# EAGLE design USB_stick (EAGLE 7.2.0)
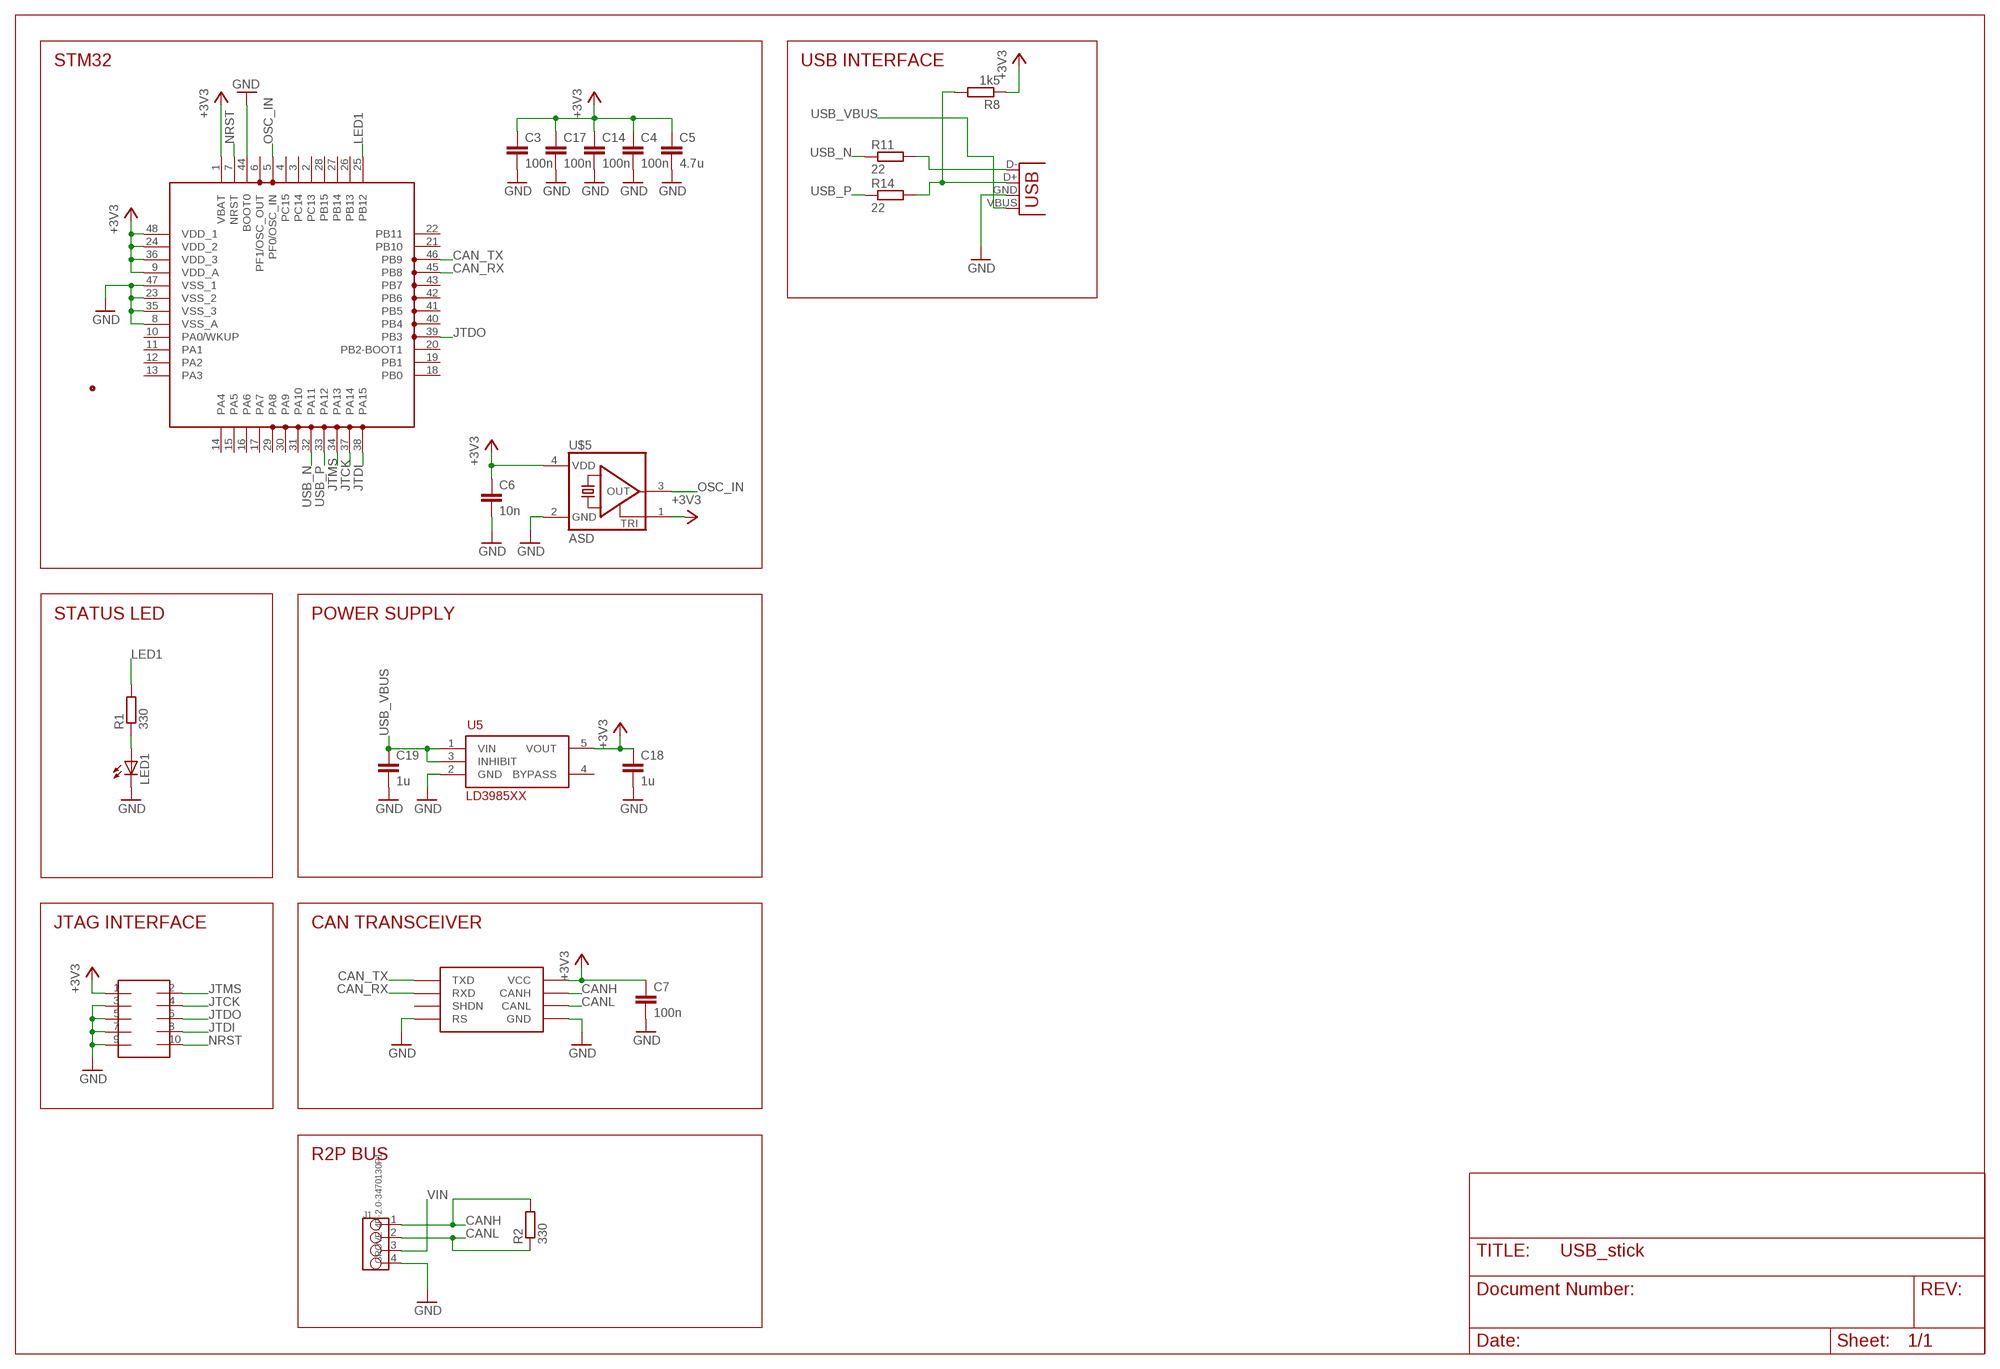
[diagram p0: schematic, sheet 1]

## Parts
C3  100n  C-EUC0603  [C0603]
C4  100n  C-EUC0603  [C0603]
C5  4.7u  C-EUC0805  [C0805]
C6  10n  C-EUC0603  [C0603]
C7  100n  C-EUC0603  [C0603]
C14  100n  C-EUC0603  [C0603]
C17  100n  C-EUC0603  [C0603]
C18  1u  C-EUC0603  [C0603]
C19  1u  C-EUC0603  [C0603]
J1  GROVE-4P-2.0-3470130P1  [4P-2.0]
JP1  USB-A-H  [USB-A-H]
LED1  LEDCHIPLED_0805  [CHIPLED_0805]
R1  330  R0603  [R0603]
R2  330  R0603  [R0603]
R8  1k5  R0603  [R0603]
R11  22  R0603  [R0603]
R14  22  R0603  [R0603]
SOT1  MAX3051EKA  [SOT23-8L]
U5  LD3985XX  [SOT23-5L]
U$4  FTSH-105TH  [FTSH-105-TH]
U$5  ASD  [2.5X2]
U$6  STM32F303C  [LQFP48]

## Nets
+3V3: C3.1 C4.1 C5.1 C6.1 C7.1 C14.1 C17.1 C18.1 R8.1 SOT1.3(VCC) U5.5(VOUT) U$4.1 U$5.1(TRI) U$5.4(VDD) U$6.1(VBAT) U$6.9(VDD_A) U$6.24(VDD_2) U$6.36(VDD_3) U$6.48(VDD_1)
CAN_RX: SOT1.4(RXD) U$6.45(PB8)
CAN_TX: SOT1.1(TXD) U$6.46(PB9)
CANH: J1.1 R2.2 SOT1.7(CANH)
CANL: J1.2 R2.1 SOT1.6(CANL)
GND: C3.2 C4.2 C5.2 C6.2 C7.2 C14.2 C17.2 C18.2 C19.2 J1.4 JP1.GND(VBUS) LED1.C SOT1.2(GND) SOT1.8(RS) U5.2(GND) U$4.3 U$4.5 U$4.7 U$4.9 U$5.2(GND) U$6.8(VSS_A) U$6.23(VSS_2) U$6.35(VSS_3) U$6.44(BOOT0) U$6.47(VSS_1)
JTCK: U$4.4 U$6.37(PA14)
JTDI: U$4.8 U$6.38(PA15)
JTDO: U$4.6 U$6.39(PB3)
JTMS: U$4.2 U$6.34(PA13)
LED1: R1.2 U$6.25(PB12)
N$3: JP1.D-(D+) R11.2
N$4: LED1.A R1.1
N$32: JP1.D+(D-) R8.2 R14.2
NRST: U$4.10 U$6.7(NRST)
OSC_IN: U$5.3(OUT) U$6.5(PF0/OSC_IN)
USB_N: R11.1 U$6.32(PA11)
USB_P: R14.1 U$6.33(PA12)
USB_VBUS: C19.1 JP1.VBUS(GND) U5.1(VIN) U5.3(INHIBIT)
VIN: J1.3
Unconnected: SOT1.5(SHDN) U5.4(BYPASS) U$6.2(PC13) U$6.3(PC14) U$6.4(PC15) U$6.6(PF1/OSC_OUT) U$6.10(PA0/WKUP) U$6.11(PA1) U$6.12(PA2) U$6.13(PA3) U$6.14(PA4) U$6.15(PA5) U$6.16(PA6) U$6.17(PA7) U$6.18(PB0) U$6.19(PB1) U$6.20(PB2-BOOT1) U$6.21(PB10) U$6.22(PB11) U$6.26(PB13) U$6.27(PB14) U$6.28(PB15) U$6.29(PA8) U$6.30(PA9) U$6.31(PA10) U$6.40(PB4) U$6.41(PB5) U$6.42(PB6) U$6.43(PB7)

## Notes on the sheet
- STM32 | USB INTERFACE
- STATUS LED | POWER SUPPLY
- JTAG INTERFACE | CAN TRANSCEIVER
- R2P BUS

## Library data of the parts
C3-C7 C14 C17-C19 = rcl:C-EU: CAPACITOR, European symbol
J1 = OPL Eagle Library:GROVE-4P-2.0
JP1 = SparkFun-Connectors:USB: USB Connectors USB-B-PTH is fully proven SKU : PRT-00139/CONN-08278 USB-miniB is fully proven SKU : PRT-00587 USB-A-PCB is untested. USB-A-H is throughly reviewed, but untested. Spark Fun Electronics SKU : PRT-00437 USB-B-SMT is throughly reviewed, but untested. Needs silkscreen touching up. USB-A-S has not been used/tested USB-MB-H has not been used/tested USB-MICROB has been used. CONN-09505
LED1 = led:LED: LED OSRAM: - CHIPLED LG R971, LG N971, LY N971, LG Q971, LY Q971, LO R971, LY R971 LH N974, LH R974 LS Q976, LO Q976, LY Q976 LO Q996 - Hyper CHIPLED LW Q18S LB Q993, LB Q99A, LB R99A - SideLED LS A670, LO A670, LY A670, LG A670, LP A670 LB A673, LV A673, LT A673, LW A673 LH A674 LY A675 LS A676, LA A676, LO A676, LY A676, LW A676 LS A679, LY A679, LG A679 - Hyper Micro SIDELED® LS Y876, LA Y876, LO Y876, LY Y876 LT Y87S - SmartLED LW L88C, LW L88S LB L89C, LB L89S, LG L890 LS L89K, LO L89K, LY L89K LS L896, LA L896, LO L896, LY L896 - TOPLED LS T670, LO T670, LY T670, LG T670, LP T670 LSG T670, LSP T670, LSY T670, LOP T670, LYG T670 LG T671, LOG T671, LSG T671 LB T673, LV T673, LT T673, LW T673 LH T674 LS T676, LA T676, LO T676, LY T676, LB T676, LH T676, LSB T676, LW T676 LB T67C, LV T67C, LT T67C, LS T67K, LO T67K, LY T67K, LW E67C LS E67B, LA E67B, LO E67B, LY E67B, LB E67C, LV E67C, LT E67C LW T67C LS T679, LY T679, LG T679 LS T770, LO T770, LY T770, LG T770, LP T770 LB T773, LV T773, LT T773, LW T773 LH T774 LS E675, LA E675, LY E675, LS T675 LS T776, LA T776, LO T776, LY T776, LB T776 LHGB T686 LT T68C, LB T68C - Hyper Mini TOPLED® LB M676 - Mini TOPLED Santana® LG M470 LS M47K, LO M47K, LY M47K Source: http://www.osram.convergy.de LUXEON: - LUMILED® LXK2-PW12-R00, LXK2-PW12-S00, LXK2-PW14-U00, LXK2-PW14-V00 LXK2-PM12-R00, LXK2-PM12-S00, LXK2-PM14-U00 LXK2-PE12-Q00, LXK2-PE12-R00, LXK2-PE12-S00, LXK2-PE14-T00, LXK2-PE14-U00 LXK2-PB12-K00, LXK2-PB12-L00, LXK2-PB12-M00, LXK2-PB14-N00, LXK2-PB14-P00, LXK2-PB14-Q00 LXK2-PR12-L00, LXK2-PR12-M00, LXK2-PR14-Q00, LXK2-PR14-R00 LXK2-PD12-Q00, LXK2-PD12-R00, LXK2-PD12-S00 LXK2-PH12-R00, LXK2-PH12-S00 LXK2-PL12-P00, LXK2-PL12-Q00, LXK2-PL12-R00 Source: www.luxeon.com KINGBRIGHT: KA-3528ASYC Source: www.kingbright.com
R1 R2 R8 R11 R14 = r2p_rcl:R
SOT1 = maxim:MAX3051
U5 = st:LD3985XX
U$4 = samtec:FTSH-105
U$5 = abracon:ASD
U$6 = st:STM32F303C

## Board
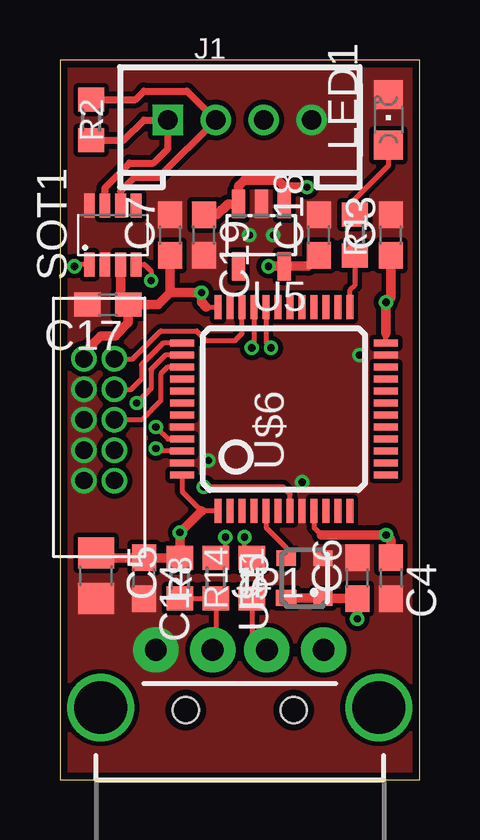
[diagram p1: board, top side]
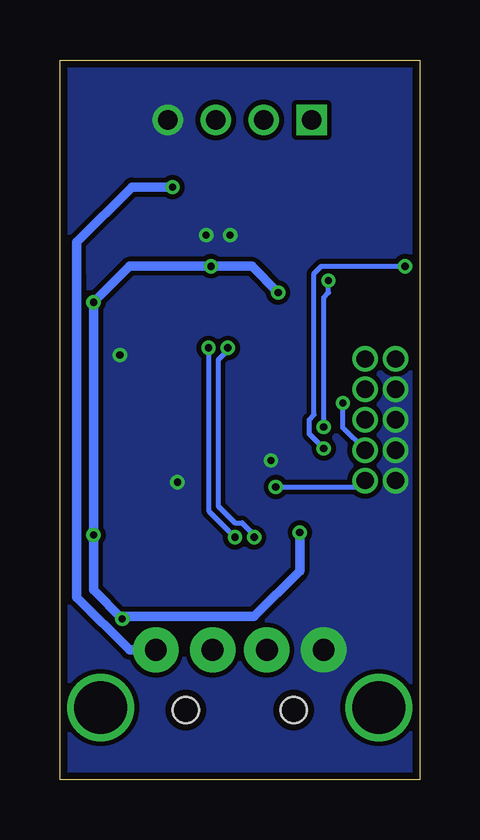
[diagram p2: board, bottom side, seen from below]

Size 15 x 30 mm. Coordinates in mm from the lower left corner, seen from the top.
Outline: 0,0 15,0 15,30 0,30 0,0
Copper layers (1*16): Top 0.035mm / dielectric 1.5mm / Bottom 0.035mm
Design rules "2layer_0.2mm": minimum track width 0.2mm, minimum drill 0.3mm, track to track 0.2mm, track to pad 0.2mm, pad to pad 0.2mm, via to via 0.2mm, smd to smd 0mil, copper to edge 0.3mm, drill to drill 0.3mm, minimum pad ring 0.15mm, minimum via ring 0.15mm, stop-mask expansion 0.05mm, vias tented up to drill 2.5mm, thermal gap 0.25mm

### Footprints (pad centres in the part's own frame; a part is rotated, then mirrored left to right if it is on the bottom)
C0603 = smd 1.1 x 1: 1 -0.85,0; 2 0.85,0
C0805 = smd 1.3 x 1.5: 1 -0.95,0; 2 0.95,0
4P-2.0 = drill 0.8 pad 1.27 square: 1 -3,0 | drill 0.8 pad 1.27: 2 -1,0; 3 1,0; 4 3,0
USB-A-H = drill 0.914 pad 1.88: D+ 2.4,1.127; D- 2.4,-1.127; GND 2.4,3.5; VBUS 2.4,-3.5 | drill 2.2: GND2 0,-5.8; GND3 0,5.8 | hole 1.1: -0.1,2.25; -0.1,-2.25
CHIPLED_0805 = smd 1.2 x 1.2: A 0,-1.05; C 0,1.05
R0603 = smd 1 x 1.1: 1 -0.85,0; 2 0.85,0
SOT23-8L = smd 0.45 x 1: 1 -0.975,-1.225; 2 -0.325,-1.225; 3 0.325,-1.225; 4 0.975,-1.225; 5 0.975,1.225; 6 0.325,1.225; 7 -0.325,1.225; 8 -0.975,1.225
SOT23-5L = smd 0.55 x 1.2: 1 -0.95,-1.3; 2 0,-1.3; 3 0.95,-1.3; 4 0.95,1.3; 5 -0.95,1.3
FTSH-105-TH = drill 0.711 pad 1.016: 1 -2.54,0; 2 -2.54,1.27; 3 -1.27,0; 4 -1.27,1.27; 5 0,0; 6 0,1.27; 7 1.27,0; 8 1.27,1.27; 9 2.54,0; 10 2.54,1.27
2.5X2 = smd 0.65 x 0.8: 1 -0.825,-0.762; 2 0.825,-0.762; 3 0.825,0.762 | smd 0.65 x 0.85: 4 -0.825,0.762
LQFP48 = smd 1 x 0.3: 1 -4.25,2.75; 2 -4.25,2.25; 3 -4.25,1.75; 4 -4.25,1.25; 5 -4.25,0.75; 6 -4.25,0.25; 7 -4.25,-0.25; 8 -4.25,-0.75; 9 -4.25,-1.25; 10 -4.25,-1.75; 11 -4.25,-2.25; 12 -4.25,-2.75; 25 4.25,-2.75; 26 4.25,-2.25; 27 4.25,-1.75; 28 4.25,-1.25; 29 4.25,-0.75; 30 4.25,-0.25; 31 4.25,0.25; 32 4.25,0.75; 33 4.25,1.25; 34 4.25,1.75; 35 4.25,2.25; 36 4.25,2.75 | smd 0.3 x 1: 13 -2.75,-4.25; 14 -2.25,-4.25; 15 -1.75,-4.25; 16 -1.25,-4.25; 17 -0.75,-4.25; 18 -0.25,-4.25; 19 0.25,-4.25; 20 0.75,-4.25; 21 1.25,-4.25; 22 1.75,-4.25; 23 2.25,-4.25; 24 2.75,-4.25; 37 2.75,4.25; 38 2.25,4.25; 39 1.75,4.25; 40 1.25,4.25; 41 0.75,4.25; 42 0.25,4.25; 43 -0.25,4.25; 44 -0.75,4.25; 45 -1.25,4.25; 46 -1.75,4.25; 47 -2.25,4.25; 48 -2.75,4.25

### Placement (x,y rotation side)
C3  13.8,22.7 90 top
C4  13.8,8.4 270 top
C5  1.5,8.5 270 top
C6  12.4,8.4 90 top
C7  4.6,22.7 90 top
C14  3.5,8.4 270 top
C17  2,19.8 180 top
C18  10.8,22.7 90 top
C19  6,22.7 270 top
J1  7.5,27.5 0 top
JP1  7.5,3 90 top
LED1  13.7,27.5 0 top
R1  12.3,22.7 270 top
R2  1.3,27.5 270 top
R8  5,8.4 270 top
R11  8,8.4 270 top
R14  6.5,8.4 270 top
SOT1  2.2,22.7 0 top
U5  8.4,22.7 180 top
U$4  1,15 270 top
U$5  10.2,8.4 90 top
U$6  9.35,15.45 90 top

### Tracks (layer width: path | path; a pad name or v marks a point on that pad's centre or on a via)
+3V3  (via drill 0.3)
  Top 0.2: U$6.9 10.6,10.5 10.9,10.2 | U$6.48 5.1,12 5.9,11.2 U$6.1 | 6.1,19.7 U$6.36 | U$6.24 13.6,18.6
  Top 0.4: v8.7,21.4 U5.5 10.35,21.4 C18.1 | C4.1 13.8,10 v13.6,10.2 10.9,10.2 | U$5.4 U$5.1 10.99,7.55 C6.1 v12.4,6.7 | 5.9,11.2 v5,10.3 R8.1 C14.1 1.7,9.25 C5.1 | SOT1.3 2.52,20.12 C17.1 | C17.1 2.85,19.05 2.3,18.5 1.7,18.5 1,17.8 U$4.1 | 6.1,19.7 5.9,19.9 v5.9,20.3 4.6,20.3 | 4.6,20.3 4.1,19.8 C17.1 | C7.1 4.6,20.3 | 13.6,18.6 v13.6,19.9 13.8,20.1 C3.1
  Bottom 0.4: v5,10.3 5,8.7 6.9,6.8 12.3,6.8 v12.4,6.7 13.6,7.9 v13.6,10.2 v13.6,19.9 12.1,21.4 v8.7,21.4 7,21.4 v5.9,20.3
CAN_RX  (via drill 0.3)
  Top 0.2: SOT1.4 3.52,21.48 3.8,21.2 v3.8,20.8 | U$6.45 4.5,14.2 4.1,14.6 v4,14.7
  Bottom 0.2: v4,14.7 4,20.1 3.8,20.3 v3.8,20.8
CAN_TX  (via drill 0.3)
  Top 0.2: SOT1.1 0.68,21.48 v0.6,21.4 | U$6.46 4.1,13.7 v4,13.8
  Bottom 0.2: v4,13.8 4.1,13.9 4.6,14.4 4.6,15 4.4,15.2 4.4,21.1 4.1,21.4 v0.6,21.4
CANH
  Top 0.3: R2.2 2.65,26.65 3.5,27.5 J1.1 4.5,26.3 3.9,25.7 2.9,25.7 1.88,24.68 SOT1.7
CANL
  Top 0.3: R2.1 3.15,28.35 3.5,28.7 5.3,28.7 J1.2 4.1,25.1 3.1,25.1 2.52,24.52 SOT1.6
GND  (via drill 0.3)
  other vias: 7.9,22.7 8.9,22.7 10.1,12.4 6.2,13.3 12.5,17.7
  pour Top (no thermals): 15,30 0,30 0,0 15,0
  pour Bottom (no thermals): 0,0 15,0 15,30 0,30
JTCK
  Top 0.2: U$6.37 4.3,18.2 3.4,17.3 3.4,16.7 2.97,16.27 U$4.4
JTDI  (via drill 0.3)
  Top 0.2: U$6.38 4.4,17.7 3.8,17.1 3.8,16.3 v3.2,15.7
  Bottom 0.2: U$4.8 3.2,14.66 v3.2,15.7
JTDO
  Top 0.2: U$6.39 4.5,17.2 4.2,16.9 4.2,15.8 3.4,15 U$4.6
JTMS
  Top 0.2: U$4.2 3.04,17.54 4.2,18.7 5.7,18.7 6.1,18.3 7.3,18.3 7.6,18.6 U$6.34
LED1
  Top 0.2: R1.2 12.3,20.6 12.1,20.4 U$6.25
N$3
  Top 0.2: R11.2 8,6.03 JP1.D-
N$4
  Top 0.2: LED1.A 13.7,25.6 12.3,24.2 R1.1
N$32
  Top 0.2: JP1.D+ 6.5,5.53 R14.2 R8.2
NRST  (via drill 0.3)
  Top 0.2: U$6.7 9.6,11.9 9.3,12.2 v6,12.2
  Bottom 0.2: v6,12.2 2.53,12.2 U$4.10
OSC_IN
  Top 0.2: U$6.5 8.6,10.5 9.4,9.7 9.44,9.66 U$5.3
USB_N  (via drill 0.3)
  Top 0.2: U$6.32 8.6,18.2 v8.8,18 | R11.1 7.7,9.55 v7.7,10.1
  Bottom 0.2: v8.8,18 8.8,11.2 v7.7,10.1
USB_P  (via drill 0.3)
  Top 0.2: U$6.33 8.1,18.1 v8,18 | R14.1 6.9,9.65 v6.9,10.1
  Bottom 0.2: v8,18 8,17.9 8.4,17.5 8.4,11.4 7.7,10.7 7.4,10.7 6.9,10.2 v6.9,10.1
USB_VBUS  (via drill 0.3)
  Top 0.4: U5.1 9.35,24.7 | 9.35,24.7 9.35,24.75 9.1,25 7.7,25 7.5,24.8 7.45,24.75 U5.3 7,24 6.55,23.55 C19.1 | v10.3,24.7 9.35,24.7
  Bottom 0.4: v10.3,24.7 12,24.7 14.3,22.4 14.3,21 14.3,8.7 14.3,7.6 12.1,5.4 JP1.VBUS

### Text on the board
200bmp: USB stick / v1.0 (2015/02)